# Altium schematic sheet Sheet1.SchDoc
size A4; SheetNumber: 3; SheetTotal: 4
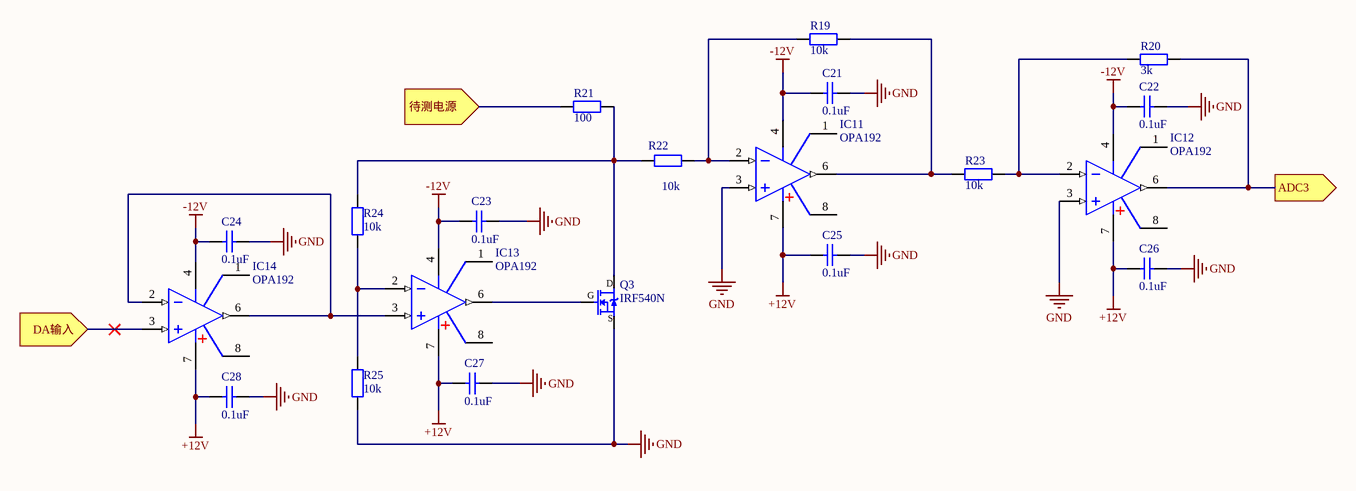
[diagram p0: Sheet1.SchDoc]

## Parts
C21  0.1uF  [瓷片电容]
C22  0.1uF  [瓷片电容]
C23  0.1uF  [瓷片电容]
C24  0.1uF  [瓷片电容]
C25  0.1uF  [瓷片电容]
C26  0.1uF  [瓷片电容]
C27  0.1uF  [瓷片电容]
C28  0.1uF  [瓷片电容]
IC11  OPA192  [SOP8_N]
IC12  OPA192  [SOP8_N]
IC13  OPA192  [SOP8_N]
IC14  OPA192  [SOP8_N]
Q3  IRF540N  [TO263-3B]
R19  10k  [RS 1/4W]
R20  3k  [RS 1/4W]
R21  100  [RS 1/4W]
R22  10k  [RS 1/4W]
R23  10k  [RS 1/4W]
R24  10k  [RS 1/4W]
R25  10k  [RS 1/4W]

## Ports
ADC3 (out), DA输入 (in), 待测电源 (in)

## Nets
+12V: C25.1 C26.1 C27.1 C28.1 IC11.7(V+) IC12.7(V+) IC13.7(V+) IC14.7(V+)
-12V: C21.1 C22.1 C23.1 C24.1 IC11.4(V-) IC12.4(V-) IC13.4(V-) IC14.4(V-)
GND: C21.2 C22.2 C23.2 C24.2 C25.2 C26.2 C27.2 C28.2 IC11.3(IN+) IC12.3(IN+) Q3.3(D) R25.1
ADC3: IC12.6(OUT) R20.2 ; port ADC3
DA输入: IC14.3(IN+) ; port DA输入
待测电源: R21.2 ; port 待测电源
NetIC11_2: IC11.2(IN-) R19.1 R22.2
NetIC11_6: IC11.6(OUT) R19.2 R23.1
NetIC12_2: IC12.2(IN-) R20.1 R23.2
NetIC13_2: IC13.2(IN-) R24.1 R25.2
NetIC13_3: IC13.3(IN+) IC14.2(IN-) IC14.6(OUT)
NetIC13_6: IC13.6(OUT) Q3.1(G)
NetQ3_2: Q3.2(S) R21.1 R22.1 R24.2

Not connected (* = marked no-connect by the designer): IC11 1 8; IC12 1 8; IC13 1 8; IC14 1 8

## Library data of the parts
C21-C28 = Cap_DIP: 直插电容; Value: 100nF; Voltage: 63V; Published: 8-Jun-2000; Revision: July-2002: Re-released for DXP Platform.; Publisher: Altium Limited; 实物样品照片: https://item.taobao.com/item.htm?spm=a230r.1.14.32.21fd24b7VWml4d&id=37914290992&ns=1&abbucket=13#detail
IC11-IC14 = OPA192: High-Voltage, Rail-to-Rail Input/Output, 5µV, 0.2µV/˚C, Precision Operational Amplifier; BOM名称: 单路精密运放; 版权归属: 源创客; 学习资源: www.ooocke.com
Q3 = IRF540N: N沟场 100V/22A; BOM名称: 效应管; 版权归属: 源创客; 学习资源: www.ooocke.com; 描述: N沟场 100V/22A
R19-R25 = Res_DIP: 直插电阻